# Altium schematic sheet Supply_GEM.SchDoc: Power supply
size 420 x 297 mm; Author: G.K.; CompanyName: WUT; DrawnBy: G.K.; Organization: WUT ISE; Address1: Warsaw Univeristy of Technology; Address2: Nowowiejska 15/19; DocumentNumber: 3; Revision: -; SheetNumber: 3; SheetTotal: 7; EDA_Number: ARTIQ; Projet: ARTIQ/SINARA; ModifiedBy: -; CreateDate: XX/XX/XXXX; CheckedDate: -; Title2: DC/DC & LDOs v1.5; DivGrp: ISE; Designer: G.K.; ModifiedDate: -; ProjectName: ARTIQ/SINARA
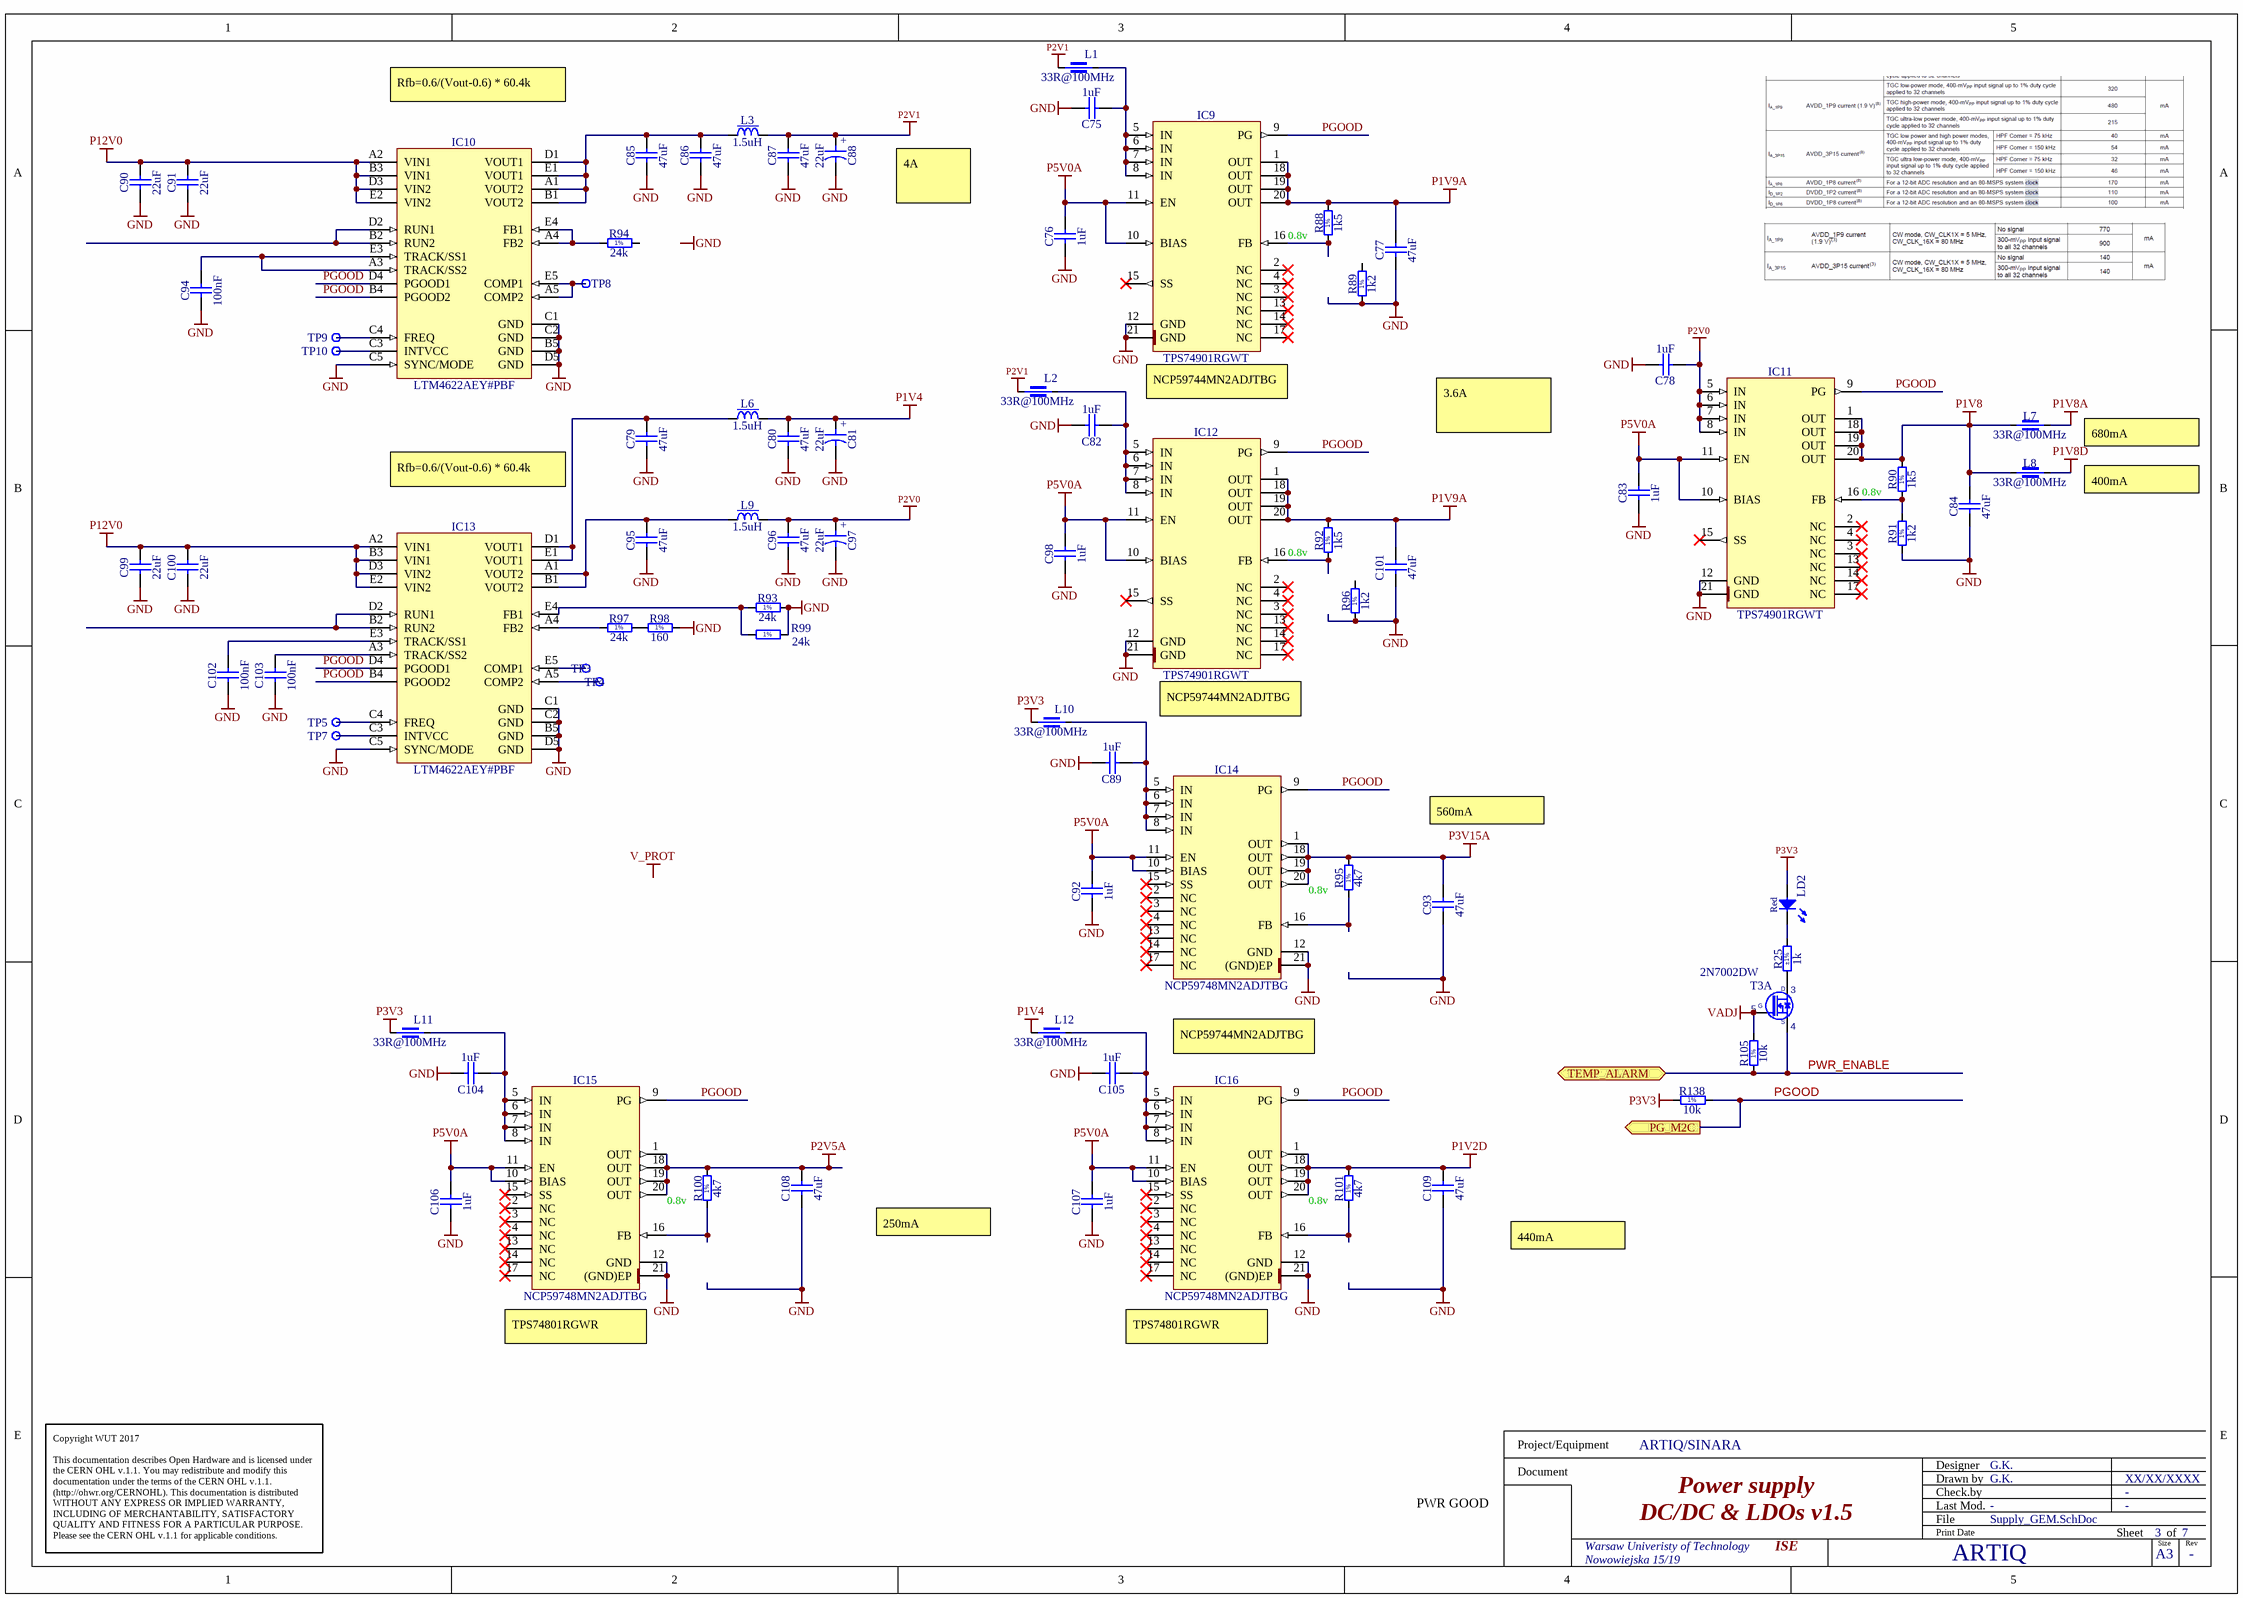
[diagram p0: Supply_GEM.SchDoc]

## Parts
C75  1uF  [CAPC1005X55N]
C76  1uF  [CAPC1005X55N]
C77  47uF  [CAPC3225X270N]
C78  1uF  [CAPC1005X55N]
C79  47uF  [CAPC3225X270N]
C80  47uF  [CAPC3225X270N]
C81  22uF  [CAPMP3528X210N]
C82  1uF  [CAPC1005X55N]
C83  1uF  [CAPC1005X55N]
C84  47uF  [CAPC3225X270N]
C85  47uF  [CAPC3225X270N]
C86  47uF  [CAPC3225X270N]
C87  47uF  [CAPC3225X270N]
C88  22uF  [CAPMP3528X210N]
C89  1uF  [CAPC1005X55N]
C90  22uF  [CAPC2012X135N]
C91  22uF  [CAPC2012X135N]
C92  1uF  [CAPC1005X55N]
C93  47uF  [CAPC3225X270N]
C94  100nF  [CAPC1005X55N]
C95  47uF  [CAPC3225X270N]
C96  47uF  [CAPC3225X270N]
C97  22uF  [CAPMP3528X210N]
C98  1uF  [CAPC1005X55N]
C99  22uF  [CAPC2012X135N]
C100  22uF  [CAPC2012X135N]
C101  47uF  [CAPC3225X270N]
C102  100nF  [CAPC1005X55N]
C103  100nF  [CAPC1005X55N]
C104  1uF  [CAPC1005X55N]
C105  1uF  [CAPC1005X55N]
C106  1uF  [CAPC1005X55N]
C107  1uF  [CAPC1005X55N]
C108  47uF  [CAPC3225X270N]
C109  47uF  [CAPC3225X270N]
IC9  TPS74901RGWT  [QFN65P500X500X100-21N-S325]
IC10  LTM4622AEY#PBF  [BGA25C127P5X5_625X625X262]
IC11  TPS74901RGWT  [QFN65P500X500X100-21N-S325]
IC12  TPS74901RGWT  [QFN65P500X500X100-21N-S325]
IC13  LTM4622AEY#PBF  [BGA25C127P5X5_625X625X262]
IC14  NCP59748MN2ADJTBG  [QFN65P500X500X100-21N-S325]
IC15  NCP59748MN2ADJTBG  [QFN65P500X500X100-21N-S325]
IC16  NCP59748MN2ADJTBG  [QFN65P500X500X100-21N-S325]
L1  33R@100MHz  [INDC1608X95N]
L2  33R@100MHz  [INDC1608X95N]
L3  1.5uH  [IND_TDK_SPM6530]
L6  1.5uH  [IND_TDK_SPM6530]
L7  33R@100MHz  [INDC1608X95N]
L8  33R@100MHz  [INDC1608X95N]
L9  1.5uH  [IND_TDK_SPM6530]
L10  33R@100MHz  [INDC1608X95N]
L11  33R@100MHz  [INDC1608X95N]
L12  33R@100MHz  [INDC1608X95N]
LD2  Red  [LED_AVAGO_HSMC-C110]
R25  1k  Tolerance: ±1%  [RESC1005X40N]
R88  1k5  [RESC1608X55N]
R89  1k2  [RESC1608X55N]
R90  1k5  [RESC1608X55N]
R91  1k2  [RESC1608X55N]
R92  1k5  [RESC1608X55N]
R93  24k  [RESC1608X55N]
R94  24k  [RESC1608X55N]
R95  4k7  [RESC1608X55N]
R96  1k2  [RESC1608X55N]
R97  24k  [RESC1608X55N]
R98  160  [RESC1608X55N]
R99  24k  [RESC1608X55N]
R100  4k7  [RESC1608X55N]
R101  4k7  [RESC1608X55N]
R105  10k  [RESC1005X40N]
R138  10k  [RESC1005X40N]
T3  2N7002DW  [SOT65P210X110-6N]  (part A of 2)
TP3  Test Point  [TPS127]  (value not drawn)
TP4  Test Point  [TPS127]  (value not drawn)
TP5  Test Point  [TPS127]  (value not drawn)
TP7  Test Point  [TPS127]  (value not drawn)
TP8  Test Point  [TPS127]  (value not drawn)
TP9  Test Point  [TPS127]  (value not drawn)
TP10  Test Point  [TPS127]  (value not drawn)

## Ports
PG_M2C (out), TEMP_ALARM (bidir)

## Nets
GND: C75.2 C76.1 C77.1 C78.2 C79.1 C80.1 C81.2 C82.2 C83.1 C84.1 C85.1 C86.1 C87.1 C88.2 C89.2 C90.1 C91.1 C92.1 C93.1 C94.1 C95.1 C96.1 C97.2 C98.1 C99.1 C100.1 C101.1 C102.1 C103.1 C104.2 C105.2 C106.1 C107.1 C108.1 C109.1 IC9.12(GND) IC9.21(GND) IC10.B5(GND) IC10.C1(GND) IC10.C2(GND) IC10.C5(SYNC/MODE) IC10.D5(GND) IC11.12(GND) IC11.21(GND) IC12.12(GND) IC12.21(GND) IC13.B5(GND) IC13.C1(GND) IC13.C2(GND) IC13.C5(SYNC/MODE) IC13.D5(GND) IC14.12(GND) IC14.21((GND)EP) IC15.12(GND) IC15.21((GND)EP) IC16.12(GND) IC16.21((GND)EP) R89.1 R91.1 R93.2 R96.1 R98.2 R99.2
P1V2D: C109.2 IC16.1(OUT) IC16.18(OUT) IC16.19(OUT) IC16.20(OUT) R101.2
P1V4: C80.2 C81.1 L6.2 L12.1
P1V8: C84.2 IC11.1(OUT) IC11.18(OUT) IC11.19(OUT) IC11.20(OUT) L7.1 L8.1 R90.2
P1V8A: L7.2
P1V8D: L8.2
P1V9A: C77.2 C101.2 IC9.1(OUT) IC9.18(OUT) IC9.19(OUT) IC9.20(OUT) IC12.1(OUT) IC12.18(OUT) IC12.19(OUT) IC12.20(OUT) R88.2 R92.2
P2V0: C78.1 C96.2 C97.1 IC11.5(IN) IC11.6(IN) IC11.7(IN) IC11.8(IN) L9.2
P2V1: C87.2 C88.1 L1.1 L2.1 L3.2
P2V5A: C108.2 IC15.1(OUT) IC15.18(OUT) IC15.19(OUT) IC15.20(OUT) R100.2
P3V3: L10.1 L11.1 LD2.2(A) R138.1
P3V15A: C93.2 IC14.1(OUT) IC14.18(OUT) IC14.19(OUT) IC14.20(OUT) R95.2
P5V0A: C76.2 C83.2 C92.2 C98.2 C106.2 C107.2 IC9.10(BIAS) IC9.11(EN) IC11.10(BIAS) IC11.11(EN) IC12.10(BIAS) IC12.11(EN) IC14.10(BIAS) IC14.11(EN) IC15.10(BIAS) IC15.11(EN) IC16.10(BIAS) IC16.11(EN)
P12V0: C90.2 C91.2 C99.2 C100.2 IC10.A2(VIN1) IC10.B3(VIN1) IC10.D3(VIN2) IC10.E2(VIN2) IC13.A2(VIN1) IC13.B3(VIN1) IC13.D3(VIN2) IC13.E2(VIN2)
VADJ: R105.2 T3.5(G1)
PGOOD: IC9.9(PG) IC10.B4(PGOOD2) IC10.D4(PGOOD1) IC11.9(PG) IC12.9(PG) IC13.B4(PGOOD2) IC13.D4(PGOOD1) IC14.9(PG) IC15.9(PG) IC16.9(PG) R138.2 ; port PG_M2C
PWR_ENABLE: R105.1 T3.4(S1) ; port TEMP_ALARM
NetC75_1: C75.1 IC9.5(IN) IC9.6(IN) IC9.7(IN) IC9.8(IN) L1.2
NetC79_2: C79.2 IC13.D1(VOUT1) IC13.E1(VOUT1) L6.1
NetC82_1: C82.1 IC12.5(IN) IC12.6(IN) IC12.7(IN) IC12.8(IN) L2.2
NetC85_2: C85.2 C86.2 IC10.A1(VOUT2) IC10.B1(VOUT2) IC10.D1(VOUT1) IC10.E1(VOUT1) L3.1
NetC89_1: C89.1 IC14.5(IN) IC14.6(IN) IC14.7(IN) IC14.8(IN) L10.2
NetC94_2: C94.2 IC10.A3(TRACK/SS2) IC10.E3(TRACK/SS1)
NetC95_2: C95.2 IC13.A1(VOUT2) IC13.B1(VOUT2) L9.1
NetC102_2: C102.2 IC13.E3(TRACK/SS1)
NetC103_2: C103.2 IC13.A3(TRACK/SS2)
NetC104_1: C104.1 IC15.5(IN) IC15.6(IN) IC15.7(IN) IC15.8(IN) L11.2
NetC105_1: C105.1 IC16.5(IN) IC16.6(IN) IC16.7(IN) IC16.8(IN) L12.2
NetIC9_16: IC9.16(FB) R88.1
NetIC10_A4: IC10.A4(FB2) IC10.E4(FB1) R94.1
NetIC10_A5: IC10.A5(COMP2) IC10.E5(COMP1) TP8.1
NetIC10_B2: IC10.B2(RUN2) IC10.D2(RUN1)
NetIC10_C3: IC10.C3(INTVCC) TP10.1
NetIC10_C4: IC10.C4(FREQ) TP9.1
NetIC11_16: IC11.16(FB) R90.1 R91.2
NetIC12_16: IC12.16(FB) R92.1
NetIC13_A4: IC13.A4(FB2) R97.1
NetIC13_A5: IC13.A5(COMP2) TP4.1
NetIC13_B2: IC13.B2(RUN2) IC13.D2(RUN1)
NetIC13_C3: IC13.C3(INTVCC) TP7.1
NetIC13_C4: IC13.C4(FREQ) TP5.1
NetIC13_E4: IC13.E4(FB1) R93.1 R99.1
NetIC13_E5: IC13.E5(COMP1) TP3.1
NetIC14_16: IC14.16(FB) R95.1
NetIC15_16: IC15.16(FB) R100.1
NetIC16_16: IC16.16(FB) R101.1
NetLD2_1: LD2.1(C) R25.2
NetR25_1: R25.1 T3.3(D1)
NetR97_2: R97.2 R98.1

Not connected (* = marked no-connect by the designer): IC9 2(NC)* 3(NC)* 4(NC)* 13(NC)* 14(NC)* 15(SS)* 17(NC)*; IC11 2(NC)* 3(NC)* 4(NC)* 13(NC)* 14(NC)* 15(SS)* 17(NC)*; IC12 2(NC)* 3(NC)* 4(NC)* 13(NC)* 14(NC)* 15(SS)* 17(NC)*; IC14 2(NC)* 3(NC)* 4(NC)* 13(NC)* 14(NC)* 15(SS)* 17(NC)*; IC15 2(NC)* 3(NC)* 4(NC)* 13(NC)* 14(NC)* 15(SS)* 17(NC)*; IC16 2(NC)* 3(NC)* 4(NC)* 13(NC)* 14(NC)* 15(SS)* 17(NC)*; R89 2; R94 2; R96 2

## Notes on the sheet
- Rfb=0.6/(Vout-0.6) * 60.4k
- 4A
- 0.8v
- (near IC9) NCP59744MN2ADJTBG
- 3.6A
- 680mA
- 400mA
- (near IC12) NCP59744MN2ADJTBG
- 560mA
- NCP59744MN2ADJTBG
- 250mA
- 440mA
- (near IC15) TPS74801RGWR
- (near IC16) TPS74801RGWR
- Copyright WUT 2017
  This documentation describes Open Hardware and is licensed under the CERN OHL v.1.1. You may redistribute and modify this documentation under the terms of the CERN OHL v.1.1. (http://ohwr.org/CERNOHL). This documentation is distributed WITHOUT ANY EXPRESS OR IMPLIED WARRANTY, INCLUDING OF MERCHANTABILITY, SATISFACTORY QUALITY AND FITNESS FOR A PARTICULAR PURPOSE. Please see the CERN OHL v.1.1 for applicable conditions.
- PWR GOOD
- Labels drawn without touching a wire or pin: GND, V_PROT
- Project/Equipment
- Document
- Designer
- Drawn by
- Check.by
- File
- Last Mod.
- Print Date
- Sheet
- Size
- A3
- of
- Rev
- (in symbol 2N7002DW, part A) D; G; S
- (in symbol CTE3528-21_22UF_10V_10%_LESR0700) +
- (in symbol R0402_10K_1%_0.0625W_100PPM) 1%
- (in symbol R0603_1K2_1%_0.1W_100PPM) 1%
- (in symbol R0603_1K5_1%_0.1W_100PPM) 1%
- (in symbol R0603_4K7_1%_0.1W_100PPM) 1%
- (in symbol R0603_24K_1%_0.1W_100PPM) 1%
- (in symbol R0603_160R_1%_0.1W_100PPM) 1%

## Library data of the parts
C75 C76 C78 C82 C83 C89 C92 C98 C104-C107 = CC0402_1UF_16V_10%_X5R: Non-polarised capacitor; Part Description: SMD Multilayer Chip Ceramic Capacitor; Manufacturer: GENERIC; Manufacturer1 Part Number: C1005X5R1C105KT; Voltage: 16V; TC: X5R; Tolerance: ±10%; Part Number: CC0402_1UF_16V_10%_X5R; Component Kind: Standard; Component Type: Standard; Pin Count: 2; Value: 1uF; Status: Preferred; Manufacturer Part Number: CC0402_1UF_16V_10%_X5R; Case: 0402; Mounted: Yes; Socket: No; SMD: Yes; Sense: No; Manufacturer1 Example: TDK; Manufacturer1 ComponentHeight: 0.55mm; HelpURL: \\cern.ch\dfs\Applications\Altium\Datasheets\CC0402_X5R_TDK_C.pdf; Author: CERN DEM JLC; CreateDate: 2012-10-25; LatestRevisionDate: 2012-10-25
C77 C79 C80 C84-C87 C93 C95 C96 C101 C108 C109 = CC1210_47UF_10V_20%_X5R: Non-polarised capacitor; Part Description: SMD Multilayer Chip Ceramic Capacitor; Manufacturer: GENERIC; Manufacturer1 Part Number: LMK325BJ476MM-T; Voltage: 10V; TC: X5R; Tolerance: ±20%; Part Number: CC1210_47UF_10V_20%_X5R; Component Kind: Standard; Component Type: Standard; Pin Count: 2; Value: 47uF; Status: None; Manufacturer Part Number: CC1210_47UF_10V_20%_X5R; Case: 1210; Mounted: Yes; Socket: No; SMD: Yes; Sense: No; Manufacturer1 Example: TAIYO YUDEN; Manufacturer1 ComponentHeight: 2.7mm; HelpURL: \\cern.ch\dfs\Applications\Altium\Datasheets\CC1210_X5R_TAIYO-YUDEN_HIGH-VALUE.pdf; Author: CERN DEM JLC; CreateDate: 04.05.2011; LatestRevisionDate: 04.05.2011
C81 C88 C97 = CTE3528-21_22UF_10V_10%_LESR0700: Polarised capacitor; Part Description: Low ESR 0R7 Solid Tantalum Chip Capacitor; Manufacturer: GENERIC; Manufacturer1 Part Number: TPSB226K010R0700; Voltage: 10V; Tolerance: ±10%; Part Number: CTE3528-21_22UF_10V_10%_LESR0700; Component Kind: Standard; Component Type: Standard; Pin Count: 2; Value: 22uF; Status: Preferred; Manufacturer Part Number: CTE3528-21_22UF_10V_10%_LESR0700; Case: B; Mounted: Yes; Socket: No; SMD: Yes; Sense: No; Manufacturer1 Example: AVX; Manufacturer1 ComponentHeight: 2.1mm; HelpURL: \\cern.ch\dfs\Applications\Altium\Datasheets\CTE-LESR_AVX_TPS.pdf; Author: CERN DEM JLC; CreateDate: 05.05.2008; LatestRevisionDate: 20.01.2009
C90 C91 C99 C100 = CC0805_22UF_16V_10%_X5R: Non-polarised capacitor; Part Description: SMD Multilayer Chip Ceramic Capacitor; Manufacturer: GENERIC; Manufacturer1 Part Number: C2012X5R1C226KT; Voltage: 16V; TC: X5R; Tolerance: ±10%; Part Number: CC0805_22UF_16V_10%_X5R; Component Kind: Standard; Component Type: Standard; Pin Count: 2; Value: 22uF; Status: Preferred; Manufacturer Part Number: CC0805_22UF_16V_10%_X5R; Case: 0805; Mounted: Yes; Socket: No; SMD: Yes; Sense: No; Manufacturer1 Example: TDK; Manufacturer1 ComponentHeight: 1.35mm; HelpURL: \\cern.ch\dfs\Applications\Altium\Datasheets\CC0805_X5R_TDK_C.pdf; Author: CERN DEM JLC; CreateDate: 25.10.2012; LatestRevisionDate: 25.10.2012
C94 C102 C103 = CC0402_100NF_16V_10%_X5R: Non-polarised capacitor; Part Description: SMD Multilayer Chip Ceramic Capacitor; Manufacturer: GENERIC; Manufacturer1 Part Number: GRM155R61C104KA88D; Voltage: 16V; TC: X5R; Tolerance: ±10%; Part Number: CC0402_100NF_16V_10%_X5R; Component Kind: Standard; Component Type: Standard; Pin Count: 2; Value: 100nF; Status: None; Manufacturer Part Number: CC0402_100NF_16V_10%_X5R; Case: 0402; Mounted: Yes; Socket: No; SMD: Yes; Sense: No; Manufacturer1 Example: MURATA; Manufacturer1 ComponentHeight: 0.55mm; HelpURL: \\cern.ch\dfs\Applications\Altium\Datasheets\CC0402_X5R_MURATA_GRM.pdf; Author: CERN DEM JLC; CreateDate: 10.12.2013; LatestRevisionDate: 10.12.2013
IC9 IC11 IC12 = TPS74901RGWT: 3A, 0.8 to 3.6V Adjustable Low-Dropout Linear Regulator with Programmable Soft-Start; Part Description: 0.8V to 3.6V, 3.0A Low Dropout Linear Regulator with Programmable Soft-Start; Manufacturer: TEXAS INSTRUMENTS; PressFit: No; Bonding: No; Part Number: TPS74901RGWT; Component Kind: Standard; Component Type: Standard; Device: TPS74901RGWT; PackageDescription: QFN, 0.65mm pitch,square; 20 pin, 5mm X 5mm X 1mm H body (w/thermal tab 3.25 X 3.25mm),  IPC Medium Density; Manufacturer Part Number: TPS74901RGWT; Pin Count: 21; Case: QFN20; Mounted: Yes; Socket: No; SMD: Yes; Sense: No; ComponentHeight: 1mm; HelpURL: \\cern.ch\dfs\Applications\Altium\Datasheets\TPS74901RGWT.pdf; Author: CERN DEM JLC; CreateDate: 07.03.2013; LatestRevisionDate: 07.03.2013
IC10 IC13 = LTM4622AEY#PBF: 3.6V-20V To 1.5V-12V, Dual 2A or Single 4A  Ultrathin Step-Down DC/DC µModule Regulator; Part Description: 3.6V-20V To 1.5V-12V, Dual 2A or Single 4A  Ultrathin Step-Down DC/DC uModule Regulator; Manufacturer: LINEAR TECHNOLOGY; PressFit: No; Bonding: No; Part Number: LTM4622AEY#PBF; Component Kind: Standard; Component Type: Standard; Device: LTM4622AEY#PBF; PackageDescription: BGA, 1.27mm Pitch, Square; 25 Pin, 5 Columns X 5 Rows, 6.25mm X 6.25mm X 2.62mm H; Manufacturer Part Number: LTM4622AEY#PBF; Pin Count: 25; Case: BGA25; Mounted: Yes; Socket: No; SMD: Yes; Sense: No; ComponentHeight: 2.62mm; HelpURL: \\cern.ch\dfs\Applications\Altium\Datasheets\LTM4622AEY#PBF.pdf; Author: CERN DEM MR; CreateDate: 29.09.2017; LatestRevisionDate: 29.09.2017
IC14-IC16 = NCP59748MN2ADJTBG: 1.5A, Dual-Rail Very Low‐Dropout Linear Regulator with Programmable Soft‐Start; Part Description: 0.8V to  3.6V, 1.5A, Dual-Rail, Very Low‐Dropout Linear Regulator with Programmable Soft‐Start; Manufacturer: ON SEMICONDUCTOR; PressFit: No; Bonding: No; Part Number: NCP59748MN2ADJTBG; Component Kind: Standard; Component Type: Standard; Device: NCP59748MN2ADJTBG; PackageDescription: QFN, 0.65mm Pitch, Square; 20 Pin, 5.00mm L X 5.00mm W X 1.00mm H body (w/Thermal Tab 3.25 X 3.25mm), IPC Medium Density; Manufacturer Part Number: NCP59748MN2ADJTBG; Pin Count: 21; Case: QFN20; Mounted: Yes; Socket: No; SMD: Yes; Sense: No; ComponentHeight: 1mm; HelpURL: \\cern.ch\dfs\Applications\Altium\Datasheets\NCP59748MN2ADJTBG.pdf; Author: CERN DEM MR; CreateDate: 23.08.2018; LatestRevisionDate: 23.08.2018
L1 L2 L7 L8 L10-L12 = IND0603_MURATA_BLM18PG330SN1D: Part Description: SMD EMIFIL Chip Ferrite Bead; Manufacturer: MURATA; Power: 3A; Resistance: 0.025R; Tolerance: ±25%; Part Number: IND0603_MURATA_BLM18PG330SN1D; Component Kind: Standard; Component Type: Standard; Pin Count: 2; Value: 33R@100MHz; Manufacturer Part Number: BLM18PG330SN1D; Case: 0603; Mounted: Yes; Socket: No; SMD: Yes; Sense: No; ComponentHeight: 0.95mm; HelpURL: \\cern.ch\dfs\Applications\Altium\Datasheets\IND0603_MURATA_BLM18P.pdf; Author: CERN DEM JMW; CreateDate: 19.02.2014; LatestRevisionDate: 25.10.2018
L3 L6 L9 = IND_1.5UH_20%_TDK_SPM6530: Inductor With Core; Part Description: SMD Inductor for Power Circuits (Wound Metal), SPM Series; Manufacturer: TDK; Manufacturer Part Number: SPM6530T-1R5M100; Power: 11A; Resistance: 0.0097R; Tolerance: ±20%; Part Number: IND_1.5UH_20%_TDK_SPM6530; Component Kind: Standard; Component Type: Standard; Pin Count: 2; Value: 1.5uH; Status: None; Mounted: Yes; Socket: No; SMD: Yes; Sense: No; ComponentHeight: 3mm; HelpURL: \\cern.ch\dfs\Applications\Altium\Datasheets\IND_TDK_SPM6530.pdf; Author: CERN DEM MR; CreateDate: 08.11.2016; LatestRevisionDate: 08.11.2016
LD2 = LED_AVAGO_HSMC-C110: LED Red 1C 2A; Part Description: High Performance Right Angle Chip Red LED; Manufacturer: AVAGO TECHNOLOGIES; PressFit: No; Bonding: No; Part Number: LED_AVAGO_HSMC-C110; Component Kind: Standard; Component Type: Standard; Color: Red; PackageDescription: Red Chip LED, 2-Leads, Body 3.3x1.6mm, Side Emitting Package; Manufacturer Part Number: HSMC-C110; Pin Count: 2; Case: 1206; Mounted: Yes; Socket: No; SMD: Yes; Sense: No; ComponentHeight: 1.1mm; HelpURL: \\cern.ch\dfs\Applications\Altium\Datasheets\LED_AVAGO_HSMC-C110.pdf; ComponentLink1URL: \\cern.ch\dfs\Applications\Altium\Datasheets\LED_AVAGO_HSMC-C110_DESIGN-GUIDE.pdf; ComponentLink1Description: Design Guide; Author: CERN DEM JMW; CreateDate: 30.07.2009; LatestRevisionDate: 20.06.2012
R25 = R0402_1K_1%_0.0625W_100PPM: Resistor - 1%; Part Description: General Purpose Thick Film Chip Resistor; Manufacturer: GENERIC; Manufacturer1 Part Number: 232270671002L; TC: ±100ppm/°C; PressFit: No; Part Number: R0402_1K_1%_0.0625W_100PPM; Component Kind: Standard; Component Type: Standard; Pin Count: 2; Value: 1k; Status: Not Recommended; Power: 0.0625W; Manufacturer Part Number: R0402_1K_1%_0.0625W_100PPM; Case: 0402; Mounted: Yes; Sense: No; Socket: No; SMD: Yes; Manufacturer1 Example: YAGEO PHYCOMP; Manufacturer1 ComponentHeight: 0.4mm; HelpURL: \\cern.ch\dfs\Applications\Altium\Datasheets\R0402_Phycomp_RC0402.pdf; Author: CERN DEM JLC; CreateDate: 03.12.2007; LatestRevisionDate: 17.10.2012
R88 R90 R92 = R0603_1K5_1%_0.1W_100PPM: Resistor - 1%; Part Description: General Purpose Thick Film Chip Resistor; Manufacturer: GENERIC; Manufacturer1 Part Number: NRC06F1501TRF; Power: 0.1W; TC: ±100ppm/°C; Part Number: R0603_1K5_1%_0.1W_100PPM; Component Kind: Standard; Component Type: Standard; Pin Count: 2; Value: 1k5; Status: Preferred; Tolerance: ±1%; Manufacturer Part Number: R0603_1K5_1%_0.1W_100PPM; Case: 0603; Mounted: Yes; Sense: No; Socket: No; SMD: Yes; Manufacturer1 Example: NIC COMPONENT; Manufacturer1 ComponentHeight: 0.55mm; HelpURL: \\cern.ch\dfs\Applications\Altium\Datasheets\R0603_NIC_NRC.pdf; Author: CERN DEM JLC; CreateDate: 03.12.2007; LatestRevisionDate: 13.03.2008
R89 R91 R96 = R0603_1K2_1%_0.1W_100PPM: Resistor - 1%; Part Description: General Purpose Thick Film Chip Resistor; Manufacturer: GENERIC; Manufacturer1 Part Number: NRC06F1201TRF; Power: 0.1W; TC: ±100ppm/°C; Part Number: R0603_1K2_1%_0.1W_100PPM; Component Kind: Standard; Component Type: Standard; Pin Count: 2; Value: 1k2; Status: Preferred; Tolerance: ±1%; Manufacturer Part Number: R0603_1K2_1%_0.1W_100PPM; Case: 0603; Mounted: Yes; Sense: No; Socket: No; SMD: Yes; Manufacturer1 Example: NIC COMPONENT; Manufacturer1 ComponentHeight: 0.55mm; HelpURL: \\cern.ch\dfs\Applications\Altium\Datasheets\R0603_NIC_NRC.pdf; Author: CERN DEM JLC; CreateDate: 03.12.2007; LatestRevisionDate: 13.03.2008
R93 R94 R97 R99 = R0603_24K_1%_0.1W_100PPM: Resistor - 1%; Part Description: General Purpose Thick Film Chip Resistor; Manufacturer: GENERIC; Manufacturer1 Part Number: NRC06F2402TRF; Power: 0.1W; TC: ±100ppm/°C; PressFit: No; Part Number: R0603_24K_1%_0.1W_100PPM; Component Kind: Standard; Component Type: Standard; Pin Count: 2; Value: 24k; Status: Preferred; Tolerance: ±1%; Manufacturer Part Number: R0603_24K_1%_0.1W_100PPM; Case: 0603; Mounted: Yes; Sense: No; Socket: No; SMD: Yes; Manufacturer1 Example: NIC COMPONENT; Manufacturer1 ComponentHeight: 0.55mm; HelpURL: \\cern.ch\dfs\Applications\Altium\Datasheets\R0603_NIC_NRC.pdf; Author: CERN DEM JLC; CreateDate: 03.12.2007; LatestRevisionDate: 13.03.2008
R95 R100 R101 = R0603_4K7_1%_0.1W_100PPM: Resistor - 1%; Part Description: General Purpose Thick Film Chip Resistor; Manufacturer: GENERIC; Manufacturer1 Part Number: NRC06F4701TRF; Power: 0.1W; TC: ±100ppm/°C; PressFit: No; Part Number: R0603_4K7_1%_0.1W_100PPM; Component Kind: Standard; Component Type: Standard; Pin Count: 2; Value: 4k7; Status: Preferred; Tolerance: ±1%; Manufacturer Part Number: R0603_4K7_1%_0.1W_100PPM; Case: 0603; Mounted: Yes; Sense: No; Socket: No; SMD: Yes; Manufacturer1 Example: NIC COMPONENT; Manufacturer1 ComponentHeight: 0.55mm; HelpURL: \\cern.ch\dfs\Applications\Altium\Datasheets\R0603_NIC_NRC.pdf; Author: CERN DEM JLC; CreateDate: 03.12.2007; LatestRevisionDate: 13.03.2008
R98 = R0603_160R_1%_0.1W_100PPM: Resistor - 1%; Part Description: General Purpose Thick Film Chip Resistor; Manufacturer: GENERIC; Manufacturer1 Part Number: NRC06F1600TRF; Power: 0.1W; TC: ±100ppm/°C; PressFit: No; Part Number: R0603_160R_1%_0.1W_100PPM; Component Kind: Standard; Component Type: Standard; Pin Count: 2; Value: 160; Status: Preferred; Tolerance: ±1%; Manufacturer Part Number: R0603_160R_1%_0.1W_100PPM; Case: 0603; Mounted: Yes; Sense: No; Socket: No; SMD: Yes; Manufacturer1 Example: NIC COMPONENT; Manufacturer1 ComponentHeight: 0.55mm; HelpURL: \\cern.ch\dfs\Applications\Altium\Datasheets\R0603_NIC_NRC.pdf; Author: CERN DEM JLC; CreateDate: 03.12.2007; LatestRevisionDate: 13.03.2008
R105 = R0402_10K_1%_0.0625W_100PPM: Resistor - 1%; Part Description: General Purpose Thick Film Chip Resistor; Manufacturer: GENERIC; Manufacturer1 Part Number: 232270671003L; TC: ±100ppm/°C; Table: Resistors SMD; Part Number: R0402_10K_1%_0.0625W_100PPM; Component Kind: Standard; Component Type: Standard; Pin Count: 2; Value: 10k; Status: Not recommended; Power: 0.0625W; Tolerance: ±1%; Manufacturer Part Number: R0402_10K_1%_0.0625W_100PPM; Case: 0402; Mounted: Yes; Socket: No; SMD: Yes; Manufacturer1 Example: YAGEO PHYCOMP; Manufacturer1 ComponentHeight: 0.4mm; HelpURL: \\cern.ch\dfs\Applications\Altium\Datasheets\R0402_Phycomp_RC0402.pdf; Author: CERN DEM JLC; CreateDate: 3/12/2007; LatestRevisionDate: 17/10/2012
R138 = R0402_10K_1%_0.0625W_100PPM: Resistor - 1%; Part Description: General Purpose Thick Film Chip Resistor; Manufacturer: GENERIC; Manufacturer1 Part Number: 232270671003L; TC: ±100ppm/°C; PressFit: No; Part Number: R0402_10K_1%_0.0625W_100PPM; Component Kind: Standard; Component Type: Standard; Pin Count: 2; Value: 10k; Status: Not Recommended; Power: 0.0625W; Tolerance: ±1%; Manufacturer Part Number: R0402_10K_1%_0.0625W_100PPM; Case: 0402; Mounted: Yes; Sense: No; Socket: No; SMD: Yes; Manufacturer1 Example: YAGEO PHYCOMP; Manufacturer1 ComponentHeight: 0.4mm; HelpURL: \\cern.ch\dfs\Applications\Altium\Datasheets\R0402_Phycomp_RC0402.pdf; Author: CERN DEM JLC; CreateDate: 03.12.2007; LatestRevisionDate: 17.10.2012
T3 = 2N7002DW: 60 V, 115 mA, Dual N-Channel Field Effect Transistor, Enhancement Mode; Part Description: 60V 115mA Dual N-Channel Field Effect Transistor, Enhancement Mode; Manufacturer: ON SEMICONDUCTOR; PressFit: No; Bonding: No; Part Number: 2N7002DW; Component Kind: Standard; Component Type: Standard; Device: 2N7002DW; PackageDescription: SOT363, SC70-6, 0.65mm Pitch; 6 Pin, 1.25mm W X 2.00mm L X 1.10mm H body, IPC Medium Density; Manufacturer Part Number: 2N7002DW; Pin Count: 6; Case: SOT363; Mounted: Yes; Socket: No; SMD: Yes; Sense: No; ComponentHeight: 1.1mm; HelpURL: \\cern.ch\dfs\Applications\Altium\Datasheets\2N7002DW.pdf; Author: CERN DEM BC; CreateDate: 25.11.2020; LatestRevisionDate: 25.11.2020
TP3-TP5 TP7-TP10 = SMD_PAD_1.27X1.27MM: Part Description: 1.27mm x 1.27mm PCB Copper Area (SMD Test Point); Mounted: No; Part Number: SMD_PAD_1.27X1.27MM; Component Kind: Standard (No BOM); Component Type: Standard (No BOM); Pin Count: 1; Family: Test Point; Socket: No; SMD: Yes; Sense: No; Status: None; ComponentHeight: 0mm; HelpURL: Undefined; Author: CERN DEM JLC; CreateDate: 12.01.2008; LatestRevisionDate: 12.01.2008; PackageDescription: 1.27mm x 1.27mm PCB Copper Area (SMD Test Point)